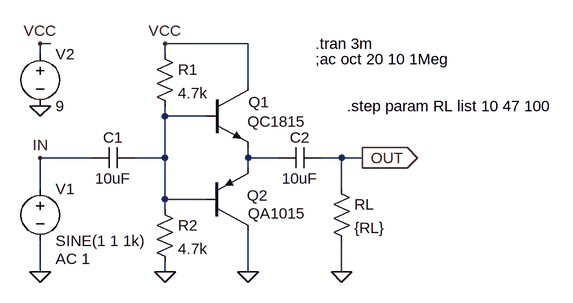
[diagram p0: schematic Push-Pull_Ex.asc]
Push-Pull_Ex.asc, the LTspice schematic file:
Version 4
SHEET 1 880 680
WIRE -32 0 -48 0
WIRE 272 0 144 0
WIRE -48 16 -48 0
WIRE 144 16 144 0
WIRE 272 64 272 0
WIRE 144 112 144 96
WIRE 208 112 144 112
WIRE 32 176 -48 176
WIRE 144 176 144 112
WIRE 144 176 96 176
WIRE 272 176 272 160
WIRE 320 176 272 176
WIRE 416 176 384 176
WIRE 448 176 416 176
WIRE 272 192 272 176
WIRE -48 224 -48 176
WIRE 416 224 416 176
WIRE 144 240 144 176
WIRE 208 240 144 240
WIRE 144 256 144 240
WIRE -48 352 -48 304
WIRE 144 352 144 336
WIRE 272 352 272 288
WIRE 416 352 416 304
FLAG 144 352 0
FLAG 272 352 0
FLAG 416 352 0
FLAG -48 352 0
FLAG -48 96 0
FLAG -48 0 VCC
FLAG 144 0 VCC
FLAG 448 176 OUT
IOPIN 448 176 Out
FLAG -48 176 IN
SYMBOL npn 208 64 R0
WINDOW 0 65 26 Left 2
WINDOW 3 63 56 Left 2
SYMATTR InstName Q1
SYMATTR Value QC1815
SYMBOL pnp 208 288 M180
WINDOW 0 62 54 Left 2
WINDOW 3 64 26 Left 2
SYMATTR InstName Q2
SYMATTR Value QA1015
SYMBOL cap 384 160 R90
WINDOW 0 0 32 VBottom 2
WINDOW 3 32 32 VTop 2
SYMATTR InstName C2
SYMATTR Value 10uF
SYMBOL res 400 208 R0
SYMATTR InstName RL
SYMATTR Value {RL}
SYMBOL res 128 0 R0
SYMATTR InstName R1
SYMATTR Value 4.7k
SYMBOL res 128 240 R0
SYMATTR InstName R2
SYMATTR Value 4.7k
SYMBOL cap 96 160 R90
WINDOW 0 0 32 VBottom 2
WINDOW 3 32 32 VTop 2
SYMATTR InstName C1
SYMATTR Value 10uF
SYMBOL voltage -48 208 R0
WINDOW 123 24 124 Left 2
WINDOW 39 0 0 Left 2
SYMATTR Value2 AC 1
SYMATTR InstName V1
SYMATTR Value SINE(1 1 1k)
SYMBOL voltage -48 0 R0
WINDOW 123 0 0 Left 2
WINDOW 39 0 0 Left 2
SYMATTR InstName V2
SYMATTR Value 9
TEXT 424 96 Left 2 !.step param RL list 10 47 100
TEXT 376 0 Left 2 !.tran 3m
TEXT 376 24 Left 2 !;ac oct 20 10 1Meg

The netlist it stands for:
* Push-Pull_Ex.asc
Q1 VCC N001 N002 0 QC1815
Q2 0 N001 N002 0 QA1015
C2 OUT N002 10uF
RL OUT 0 {RL}
R1 VCC N001 4.7k
R2 N001 0 4.7k
C1 N001 IN 10uF
V1 IN 0 SINE(1 1 1k) AC 1
V2 VCC 0 9
.model NPN NPN
.model PNP PNP
.lib standard.bjt
.step param RL list 10 47 100
.tran 3m
;ac oct 20 10 1Meg
.backanno
.end